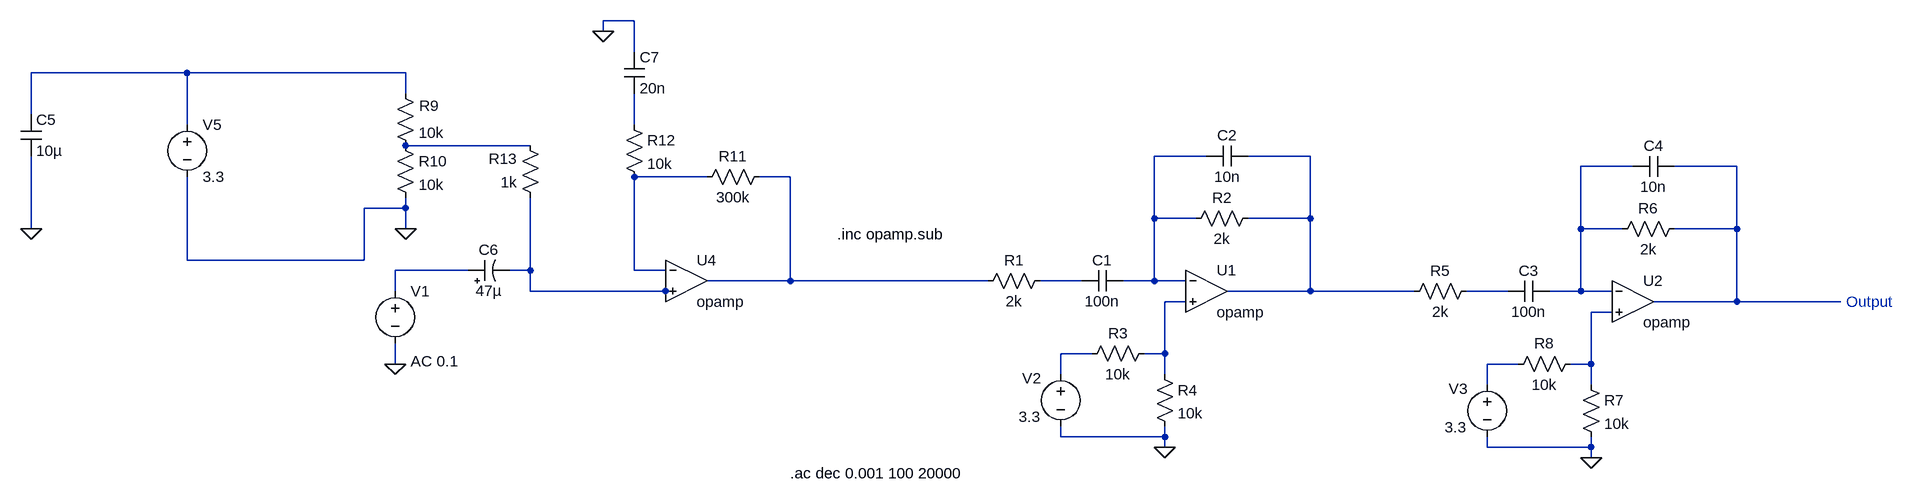
[diagram p0: schematic msc_revised.asc]
msc_revised.asc, the LTspice schematic file:
Version 4
SHEET 1 1436 712
WIRE -608 0 -656 0
WIRE -656 16 -656 0
WIRE -608 48 -608 0
WIRE -1296 80 -1536 80
WIRE -960 80 -1296 80
WIRE -960 112 -960 80
WIRE -1536 144 -1536 80
WIRE -1296 160 -1296 80
WIRE -608 160 -608 112
WIRE -768 192 -960 192
WIRE 272 208 192 208
WIRE 432 208 336 208
WIRE 928 224 848 224
WIRE 1088 224 992 224
WIRE -496 240 -608 240
WIRE -368 240 -416 240
WIRE -960 288 -960 272
WIRE -960 288 -1024 288
WIRE 192 304 192 208
WIRE 256 304 192 304
WIRE 432 304 432 208
WIRE 432 304 336 304
WIRE -1536 320 -1536 208
WIRE -960 320 -960 288
WIRE 848 320 848 224
WIRE 912 320 848 320
WIRE 1088 320 1088 224
WIRE 1088 320 992 320
WIRE -1296 368 -1296 240
WIRE -1024 368 -1024 288
WIRE -1024 368 -1296 368
WIRE -864 384 -976 384
WIRE -768 384 -768 272
WIRE -768 384 -800 384
WIRE -608 384 -608 240
WIRE -560 384 -608 384
WIRE -368 400 -368 240
WIRE -368 400 -496 400
WIRE -64 400 -368 400
WIRE 80 400 16 400
WIRE 192 400 192 304
WIRE 192 400 144 400
WIRE 240 400 192 400
WIRE -976 416 -976 384
WIRE -768 416 -768 384
WIRE -560 416 -768 416
WIRE -544 416 -560 416
WIRE 432 416 432 304
WIRE 432 416 304 416
WIRE 592 416 432 416
WIRE 736 416 672 416
WIRE 848 416 848 320
WIRE 848 416 800 416
WIRE 896 416 848 416
WIRE 240 432 208 432
WIRE 1088 432 1088 320
WIRE 1088 432 960 432
WIRE 1248 432 1088 432
WIRE 896 448 864 448
WIRE 96 512 48 512
WIRE 208 512 208 432
WIRE 208 512 176 512
WIRE -976 528 -976 496
WIRE 752 528 704 528
WIRE 864 528 864 448
WIRE 864 528 832 528
WIRE 48 544 48 512
WIRE 208 544 208 512
WIRE 704 560 704 528
WIRE 864 560 864 528
WIRE 48 640 48 624
WIRE 208 640 208 624
WIRE 208 640 48 640
WIRE 208 656 208 640
WIRE 704 656 704 640
WIRE 864 656 864 640
WIRE 864 656 704 656
WIRE 864 672 864 656
FLAG 208 656 0
FLAG 864 672 0
FLAG -960 320 0
FLAG -976 528 0
FLAG -1536 320 0
FLAG -656 16 0
SYMBOL OpAmps\\opamp 272 352 R0
SYMATTR InstName U1
SYMBOL res 32 384 R90
WINDOW 0 0 56 VBottom 2
WINDOW 3 32 56 VTop 2
SYMATTR InstName R1
SYMATTR Value 2k
SYMBOL cap 144 384 R90
WINDOW 0 0 32 VBottom 2
WINDOW 3 32 32 VTop 2
SYMATTR InstName C1
SYMATTR Value 100n
SYMBOL res 352 288 R90
WINDOW 0 0 56 VBottom 2
WINDOW 3 32 56 VTop 2
SYMATTR InstName R2
SYMATTR Value 2k
SYMBOL cap 336 192 R90
WINDOW 0 0 32 VBottom 2
WINDOW 3 32 32 VTop 2
SYMATTR InstName C2
SYMATTR Value 10n
SYMBOL res 192 528 R0
SYMATTR InstName R4
SYMATTR Value 10k
SYMBOL res 192 496 R90
WINDOW 0 0 56 VBottom 2
WINDOW 3 32 56 VTop 2
SYMATTR InstName R3
SYMATTR Value 10k
SYMBOL voltage 48 528 R0
WINDOW 0 -59 22 Left 2
WINDOW 3 -65 81 Left 2
WINDOW 123 0 0 Left 0
WINDOW 39 0 0 Left 0
SYMATTR InstName V2
SYMATTR Value 3.3
SYMBOL OpAmps\\opamp 928 368 R0
SYMATTR InstName U2
SYMBOL res 688 400 R90
WINDOW 0 0 56 VBottom 2
WINDOW 3 32 56 VTop 2
SYMATTR InstName R5
SYMATTR Value 2k
SYMBOL cap 800 400 R90
WINDOW 0 0 32 VBottom 2
WINDOW 3 32 32 VTop 2
SYMATTR InstName C3
SYMATTR Value 100n
SYMBOL res 1008 304 R90
WINDOW 0 0 56 VBottom 2
WINDOW 3 32 56 VTop 2
SYMATTR InstName R6
SYMATTR Value 2k
SYMBOL cap 992 208 R90
WINDOW 0 0 32 VBottom 2
WINDOW 3 32 32 VTop 2
SYMATTR InstName C4
SYMATTR Value 10n
SYMBOL res 848 544 R0
SYMATTR InstName R7
SYMATTR Value 10k
SYMBOL res 848 512 R90
WINDOW 0 0 56 VBottom 2
WINDOW 3 32 56 VTop 2
SYMATTR InstName R8
SYMATTR Value 10k
SYMBOL voltage 704 544 R0
WINDOW 0 -59 22 Left 2
WINDOW 3 -65 81 Left 2
WINDOW 123 0 0 Left 0
WINDOW 39 0 0 Left 0
SYMATTR InstName V3
SYMATTR Value 3.3
SYMBOL OpAmps\\opamp -528 336 R0
SYMATTR InstName U4
SYMBOL polcap -864 400 R270
WINDOW 0 32 32 VTop 2
WINDOW 3 0 32 VBottom 2
SYMATTR InstName C6
SYMATTR Value 47µ
SYMBOL res -976 96 R0
WINDOW 0 37 35 Left 2
SYMATTR InstName R9
SYMATTR Value 10k
SYMBOL res -976 176 R0
SYMATTR InstName R10
SYMATTR Value 10k
SYMBOL voltage -976 400 R0
WINDOW 123 24 124 Left 2
WINDOW 39 0 0 Left 0
SYMATTR Value2 AC 0.1
SYMATTR InstName V1
SYMATTR Value ""
SYMBOL voltage -1296 144 R0
WINDOW 123 0 0 Left 0
WINDOW 39 0 0 Left 0
SYMATTR InstName V5
SYMATTR Value 3.3
SYMBOL res -400 224 R90
WINDOW 0 0 56 VBottom 2
WINDOW 3 32 56 VTop 2
SYMATTR InstName R11
SYMATTR Value 300k
SYMBOL res -624 144 R0
SYMATTR InstName R12
SYMATTR Value 10k
SYMBOL cap -1552 144 R0
SYMATTR InstName C5
SYMATTR Value 10µ
SYMBOL res -752 288 R180
WINDOW 0 36 76 Left 2
WINDOW 3 36 40 Left 2
SYMATTR InstName R13
SYMATTR Value 1k
SYMBOL cap -624 48 R0
SYMATTR InstName C7
SYMATTR Value 20n
TEXT -296 328 Left 2 !.inc opamp.sub
TEXT -368 696 Left 2 !.ac dec 0.001 100 20000
TEXT 1256 432 Left 2 ;Output

The netlist it stands for:
* msc_revised.asc
XU1 N004 N014 N005 opamp Aol=100K GBW=10Meg  ; pins invin noninvin out
R1 N012 N009 2k
C1 N004 N012 100n
R2 N005 N004 2k
C2 N005 N004 10n
R4 N014 0 10k
R3 N014 N016 10k
V2 N016 0 3.3
XU2 N006 N015 N007 opamp Aol=100K GBW=10Meg  ; pins invin noninvin out
R5 N013 N005 2k
C3 N006 N013 100n
R6 N007 N006 2k
C4 N007 N006 10n
R7 N015 0 10k
R8 N015 N017 10k
V3 N017 0 3.3
XU4 N008 N011 N009 opamp Aol=100K GBW=10Meg  ; pins invin noninvin out
C6 N010 N011 47µ
R9 N001 N003 10k
R10 N003 0 10k
V1 N010 0 AC 0.1
V5 N001 0 3.3
R11 N009 N008 300k
R12 N002 N008 10k
C5 N001 0 10µ
R13 N011 N003 1k
C7 0 N002 20n
.inc opamp.sub
.ac dec 0.001 100 20000
* Output
.backanno
.end